# Altium schematic sheet Sheet3.SchDoc
size A; SheetNumber: 1; SheetTotal: 1
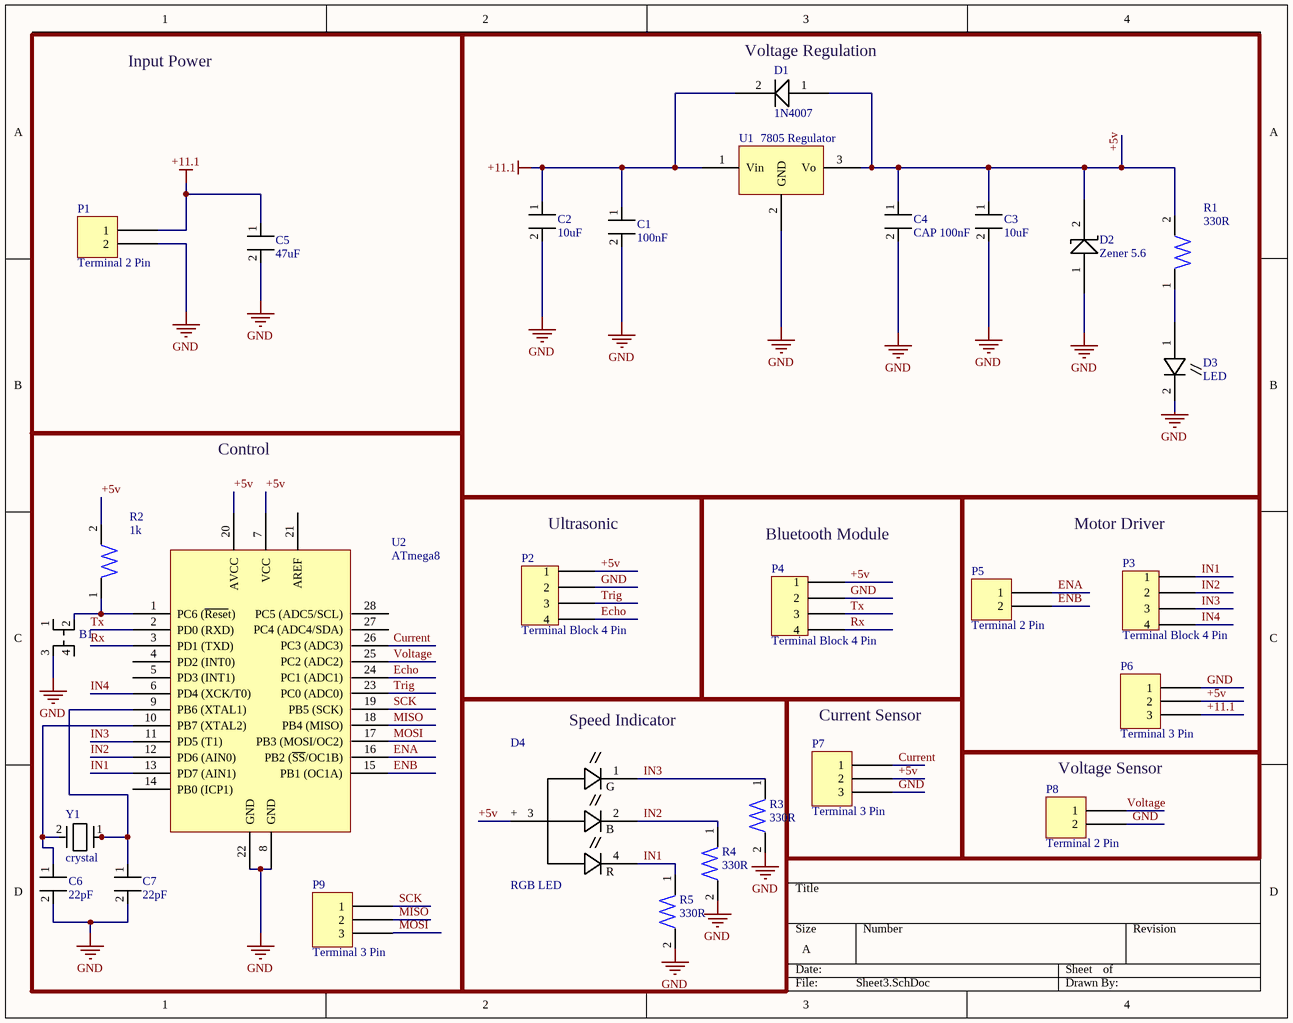
[diagram p0: Sheet3.SchDoc]

## Parts
B1  Push Button  [Push Button]  (value not drawn)
C1  100nF  [CAP 100nF]
C2  10uF  [CAP]
C3  10uF  [CAP]
C4  CAP 100nF  [CAP 100nF]
C5  47uF  [CAP]
C6  22pF  [CAP 22pF]
C7  22pF  [CAP 22pF]
D1  1N4007  [1N4007]
D2  Zener 5.6  [1N4007]
D3  LED  [LED]
D4  RGB LED  [RGB LED]
P1  Terminal 2 Pin  [Terminal 2 Pin]
P2  Terminal Block 4 Pin  [Terminal Block 4 Pin]
P3  Terminal Block 4 Pin  [Terminal Block 4 Pin]
P4  Terminal Block 4 Pin  [Terminal Block 4 Pin]
P5  Terminal 2 Pin  [Terminal 2 Pin]
P6  Terminal 3 Pin  [Terminal 3 Pin]
P7  Terminal 3 Pin  [Terminal 3 Pin]
P8  Terminal 2 Pin  [Terminal 2 Pin]
P9  Terminal 3 Pin  [Terminal 3 Pin]
R1  330R  [RES]
R2  1k  [RES]
R3  330R  [RES]
R4  330R  [RES]
R5  330R  [RES]
U1  7805 Regulator  [7805 Reg]
U2  ATmega8  [ATmega8A-PU]
Y1  crystal  [crystal]

## Blocks framed on the sheet
Input Power: C5 P1
Voltage Regulation: C1-C4 D1-D3 R1 U1
Control: B1 C6 C7 P9 R2 U2 Y1
Ultrasonic: P2
Bluetooth Module: P4
Motor Driver: P3 P5 P6
Speed Indicator: D4 R3-R5
Current Sensor: P7
Voltage Sensor: P8

## Nets
+11.1: C1.1 C2.1 C5.1 D1.2 P1.1 P6.3 U1.1(Vin)
GND: B1.3 C1.2 C2.2 C3.2 C4.2 C5.2 C6.2 C7.2 D2.1 D3.2 P1.2 P2.2 P4.2 P6.1 P7.3 P8.2 R3.2 R4.2 R5.2 U1.2(GND) U2.8(GND) U2.22(GND)
+5v: C3.1 C4.1 D1.1 D2.2 D4.3 P2.1 P4.1 P6.2 P7.2 R1.2 R2.2 U1.3(Vo) U2.7(VCC) U2.20(AVCC)
Current: P7.1 U2.26(PC3_(ADC3))
Echo: P2.4 U2.24(PC1_(ADC1))
ENA: P5.1 U2.16(PB2_(~{SS}/OC1B))
ENB: P5.2 U2.15(PB1_(OC1A))
IN1: D4.4 P3.1 R5.1 U2.13(PD7_(AIN1))
IN2: D4.2 P3.2 R4.1 U2.12(PD6_(AIN0))
IN3: D4.1 P3.3 R3.1 U2.11(PD5_(T1))
IN4: P3.4 U2.6(PD4_(XCK/T0))
MISO: P9.2 U2.18(PB4_(MISO))
MOSI: P9.3 U2.17(PB3_(MOSI/OC2))
Rx: P4.4 U2.3(PD1_(TXD))
SCK: P9.1 U2.19(PB5_(SCK))
Trig: P2.3 U2.23(PC0_(ADC0))
Tx: P4.3 U2.2(PD0_(RXD))
Voltage: P8.1 U2.25(PC2_(ADC2))
NetB1_2: B1.2 R2.1 U2.1(PC6_(~{Rese}t))
NetC6_1: C6.1 U2.10(PB7_(XTAL2)) Y1.2
NetC7_1: C7.1 U2.9(PB6_(XTAL1)) Y1.1
NetD3_1: D3.1 R1.1

Not connected (* = marked no-connect by the designer): B1 1(4) 4; U2 4(PD2_(INT0)) 5(PD3_(INT1)) 14(PB0_(ICP1)) 21(AREF) 27(PC4_(ADC4/SDA)) 28(PC5_(ADC5/SCL))

## Notes on the sheet
- (in symbol RGB LED) G; +; B; R

## Library data of the parts
C1 = CAP 100nF
C2 C3 C5 = CAP
C6 C7 = CAP 22pF
D2 = Zener
R1-R5 = RES
Y1 = crystal: Parameter 4: *